# EAGLE design M_I_ext_sound_usb (EAGLE 9.6.2)
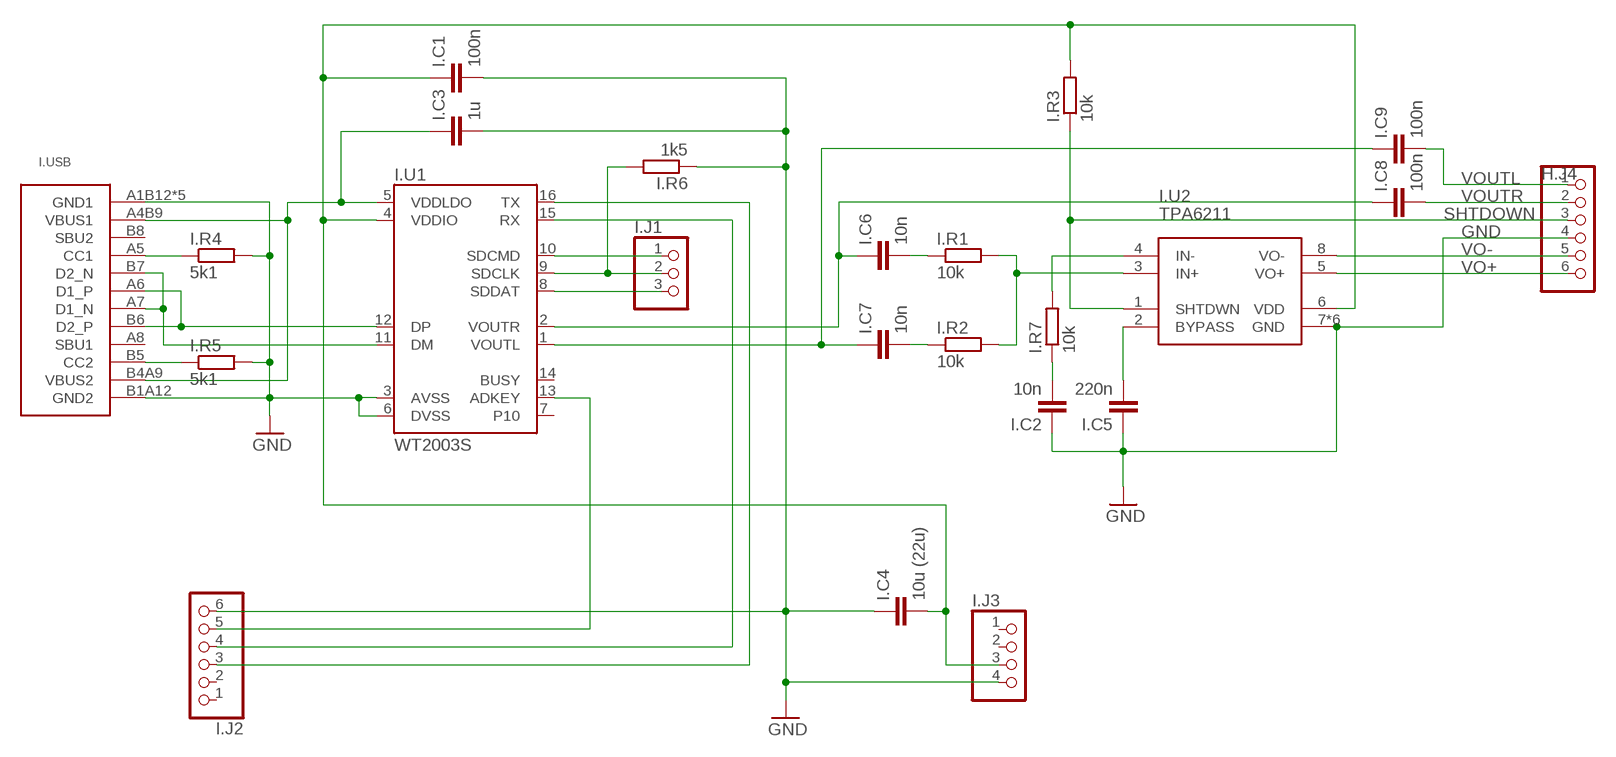
[diagram p0: schematic, sheet 1]

## Parts
H.J4  PINHD-1X6  [1X06]
I.C1  100n  C-EUC0603  [C0603]
I.C2  10n  C-EUC0603  [C0603]
I.C3  1u  C-EUC0603  [C0603]
I.C4  10u (22u)  C-EUC0805  [C0805]
I.C5  220n  C-EUC0603  [C0603]
I.C6  10n  C-EUC0603  [C0603]
I.C7  10n  C-EUC0603  [C0603]
I.C8  100n  C-EUC0603  [C0603]
I.C9  100n  C-EUC0603  [C0603]
I.J1  PINHD-1X3  [1X03]
I.J2  PINHD-1X6  [1X06]
I.J3  PINHD-1X4  [1X04]
I.R1  10k  R-EU_R0603  [R0603]
I.R2  10k  R-EU_R0603  [R0603]
I.R3  10k  R-EU_R0603  [R0603]
I.R4  5k1  R-EU_R0603  [R0603]
I.R5  5k1  R-EU_R0603  [R0603]
I.R6  1k5  R-EU_R0603  [R0603]
I.R7  10k  R-EU_R0603  [R0603]
I.U1  WT2003S  [SO16]
I.U2  TPA6211  [MSOP-POWERPAD-8]
I.USB  USB-C  [USB-C]

## Nets
GND: H.J4.4 I.C1.2 I.C2.1 I.C3.2 I.C4.1 I.C5.1 I.J2.6 I.J3.4 I.R4.2 I.R5.2 I.R6.1 I.U1.3(AVSS) I.U1.6(DVSS) I.U2.7(GND) I.U2.9(GND) I.U2.P$10(GND) I.U2.P$11(GND) I.U2.P$12(GND) I.U2.P$13(GND) I.USB.A1B12(GND1) I.USB.B1A12(GND2) I.USB.SH1(GND1) I.USB.SH2(GND1) I.USB.SH3(GND1) I.USB.SH4(GND1)
N$1: I.R5.1 I.USB.B5(CC2)
N$2: I.R4.1 I.USB.A5(CC1)
N$3: I.J2.5 I.U1.13(ADKEY)
N$6: I.R7.2 I.U2.4(IN-)
N$8: I.C2.2 I.R7.1
N$9: I.U1.12(DP) I.USB.A6(D1_P) I.USB.B6(D2_P)
N$10: I.U1.11(DM) I.USB.A7(D1_N) I.USB.B7(D2_N)
N$11: I.C3.1 I.U1.5(VDDLDO) I.USB.A4B9(VBUS1) I.USB.B4A9(VBUS2)
N$12: I.C6.1 I.C8.1 I.U1.2(VOUTR)
N$13: I.C7.1 I.C9.1 I.U1.1(VOUTL)
N$14: I.R1.2 I.R2.2 I.U2.3(IN+)
N$15: I.C5.2 I.U2.2(BYPASS)
N$17: I.C6.2 I.R1.1
N$18: I.C7.2 I.R2.1
RX: I.J2.4 I.U1.15(RX)
SDCLK: I.J1.2 I.R6.2 I.U1.9(SDCLK)
SDCMD: I.J1.1 I.U1.10(SDCMD)
SDDAT: I.J1.3 I.U1.8(SDDAT)
SHTDOWN: H.J4.3 I.R3.1 I.U2.1(SHTDWN)
TX: I.J2.3 I.U1.16(TX)
VCC: I.C1.1 I.C4.2 I.J3.3 I.R3.2 I.U1.4(VDDIO) I.U2.6(VDD)
VO+: H.J4.6 I.U2.5(VO+)
VO-: H.J4.5 I.U2.8(VO-)
VOUTL: H.J4.1 I.C9.2
VOUTR: H.J4.2 I.C8.2
Unconnected: I.J2.1 I.J2.2 I.J3.1 I.J3.2 I.U1.7(P10) I.U1.14(BUSY) I.USB.A8(SBU1) I.USB.B8(SBU2)

## Library data of the parts
H.J4 I.J2 = pinhead2:PINHD-1X6: PIN HEADER
I.C1-I.C9 = rcl:C-EU: CAPACITOR, European symbol; SPICEPREFIX: C
I.J1 = pinhead2:PINHD-1X3: PIN HEADER
I.J3 = pinhead2:PINHD-1X4: PIN HEADER
I.R1-I.R7 = rcl:R-EU_: RESISTOR, European symbol; SPICEPREFIX: R
I.U1 = WT2003S:WT2003S
I.U2 = hugo:TPA6211
I.USB = hugo:USB-C

## Board
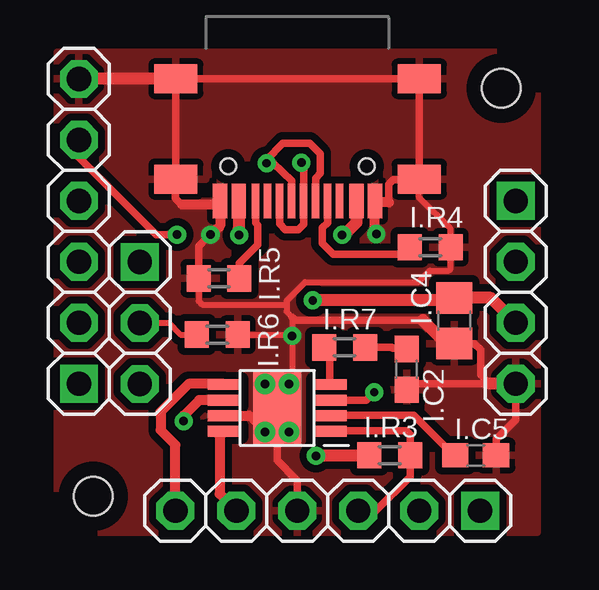
[diagram p1: board, top side]
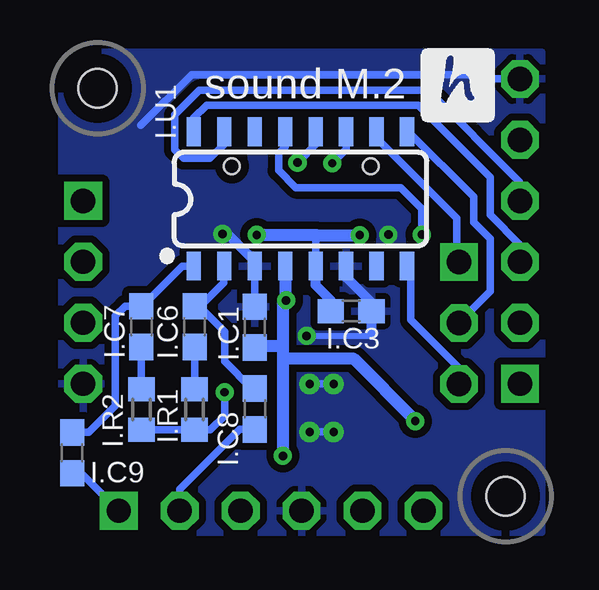
[diagram p2: board, bottom side, seen from below]

No outline drawn. Coordinates in mm, seen from the top.
Copper layers (1*16): Top 0.035mm / dielectric 1.5mm / Bottom 0.035mm
Design rules "default *": minimum track width 10mil, minimum drill 0.35mm, track to track 6mil, track to pad 6mil, pad to pad 6mil, via to via 10mil, smd to smd 6mil, copper to edge 15mil, drill to drill 15mil, minimum pad ring 10mil, minimum via ring 8mil, stop-mask expansion 4mil, vias tented up to drill 0mil, thermal gap 10mil
Holes 1.6 mm at 2,2 19,19
tRestrict: area 18,18 to 20,20; area 1,1 to 3,3
bRestrict: area 1,1 to 3,3; area 18,18 to 20,20

### Footprints (pad centres in the part's own frame; a part is rotated, then mirrored left to right if it is on the bottom)
1X06 = drill 1.016 pad 1.575 square: 1 -6.35,0 | drill 1.016 pad 1.575 octagon: 2 -3.81,0; 3 -1.27,0; 4 1.27,0; 5 3.81,0; 6 6.35,0
C0603 = smd 1.1 x 1: 1 -0.85,0; 2 0.85,0
C0805 = smd 1.3 x 1.5: 1 -0.95,0; 2 0.95,0
1X03 = drill 1.016 pad 1.575 square: 1 -2.54,0 | drill 1.016 pad 1.575 octagon: 2 0,0; 3 2.54,0
1X04 = drill 1.016 pad 1.575 square: 1 -3.81,0 | drill 1.016 pad 1.575 octagon: 2 -1.27,0; 3 1.27,0; 4 3.81,0
R0603 = smd 1 x 1.1: 1 -0.85,0; 2 0.85,0
SO16 = smd 0.6 x 1.2: 1 -4.445,-2.8; 2 -3.175,-2.8; 3 -1.905,-2.8; 4 -0.635,-2.8; 5 0.635,-2.8; 6 1.905,-2.8; 7 3.175,-2.8; 8 4.445,-2.8; 9 4.445,2.8; 10 3.175,2.8; 11 1.905,2.8; 12 0.635,2.8; 13 -0.635,2.8; 14 -1.905,2.8; 15 -3.175,2.8; 16 -4.445,2.8
MSOP-POWERPAD-8 = smd 1.4 x 0.45: 1 -2.184,0.959; 2 -2.184,0.309; 3 -2.184,-0.341; 4 -2.184,-0.991; 5 2.216,-0.991; 6 2.216,-0.341; 7 2.216,0.309; 8 2.216,0.959 | smd 2 x 3: 9 0.016,-0.016 | drill 0.35: P$10 -0.484,-1.016; P$11 0.516,-1.016; P$12 0.516,0.984; P$13 -0.484,0.984
USB-C = smd 0.6 x 1.45: A1B12 -3.235,3.825; A4B9 -2.46,3.825; B1A12 3.215,3.825; B4A9 2.44,3.825 | smd 0.3 x 1.45: A5 -1.26,3.825; A6 -0.26,3.825; A7 0.24,3.825; A8 1.24,3.825; B5 1.74,3.825; B6 0.74,3.825; B7 -0.76,3.825; B8 -1.76,3.825 | smd 1.8 x 1.2: SH1 -5.08,2.91; SH2 -5.08,-1.27; SH3 5.06,-1.27; SH4 5.06,2.91 | hole 0.65: 2.88,2.38; -2.9,2.38

### Placement (x,y rotation side)
H.J4  11.77,1.4 180 top
I.C1  12.45,9.05 90 bottom
I.C2  15.06,7.29 90 top
I.C3  8.44,9.71 0 bottom
I.C4  17.04,9.31 90 top
I.C5  17.93,3.71 180 top
I.C6  14.96,9.07 270 bottom
I.C7  17.17,9.07 270 bottom
I.C8  12.45,5.64 270 bottom
I.C9  20.07,3.81 270 bottom
I.J1  3.94,9.22 270 top
I.J2  1.4,13.04 90 top
I.J3  19.6,10.5 270 top
I.R1  14.96,5.61 270 bottom
I.R2  17.17,5.61 270 bottom
I.R3  14.35,3.71 180 top
I.R4  16.04,12.38 0 top
I.R5  7.24,11.08 180 top
I.R6  7.16,8.74 180 top
I.R7  12.47,8.2 180 top
I.U1  10.55,14.39 0 bottom
I.U2  9.68,5.66 180 top
I.USB  10.5,18.12 180 top

### Tracks (layer width: path | path; a pad name or v marks a point on that pad's centre or on a via)
GND  (via drill 0.35)
  Top 0.254: 15.57,15.19 15.57,14.46 16.89,13.14 I.R4.2 16.89,11.48 16.82,11.4 16.03,11.4 15.54,10.92 10.83,10.92 10.05,10.14 10.05,9.98 | 10.3,8.71 10.3,9.47 10.05,9.71 10.05,9.98 | 10.3,8.71 10.3,8.56 | 10.3,8.56 10.3,6.82 I.U2.P$10 | I.R5.2 6.39,10.14 6.54,9.98 10.05,9.98 | 10.3,8.56 10.29,8.57 v10.29,8.68 | I.R6.1 10.27,8.74 10.3,8.71
  Top 0.305: 5.7,14.15 5.42,14.43 I.USB.SH4 I.USB.SH3 I.USB.SH2 I.USB.SH1 15.53,15.19 | 15.57,15.19 15.53,15.19 | 15.53,15.19 14.5,15.19 14.32,15.01 14.32,14.25 | I.J2.6 | 17.04,8.59 I.C4.1 | I.C4.1 17.04,8.31 | 13.65,12.9 v13.79,12.93 | 8.49,5.36 I.U2.P$12 9.66,5.18 I.U2.9 9.66,3.49 10.5,2.65 H.J4.4 | 9.92,6.14 9.38,6.68 I.U2.P$11 9.16,6.71 9.44,6.99 | I.C4.1 16.71,8.36 | I.C4.1 17.88,8.36 18.14,8.1 18.14,7.06 18.51,6.69 15.23,6.69 I.C2.1 | 10.3,9.47 10.42,9.34 15.74,9.34 | v6.88,12.9 6.39,12.41 I.R5.2 | 17.22,6.69 I.J3.4 19.6,5.19 18.78,4.37 I.C5.1
  Top 0.406: 5.7,14.15 7.11,14.15 I.USB.B1A12 7.29,13.28 v6.88,12.9 | 14.32,14.25 13.76,14.25 I.USB.A1B12 13.73,12.99 v13.79,12.93 | I.U2.7 8.49,5.36
  Top 0.508: I.USB.SH3 I.J2.6 | I.J3.4 18.51,6.69 | 16.71,8.36 15.74,9.34
  Bottom 0.254: v10.29,8.68 7.63,8.68 7.59,8.73
  Bottom 0.305: 12.62,9.73 I.C1.2 I.U1.3 | I.U2.P$10 I.U2.P$11 | I.U2.P$13 I.U2.P$12 | 17.2,17.45 15.08,19.57 2.67,19.57 2.49,19.39 I.J2.6
  Bottom 0.406: I.U1.6 8.64,11.12 7.59,10.06 I.C3.2 7.59,8.73 | I.U1.3 12.45,11.79 13.56,12.9 v13.79,12.93
  pour Top (isolate 0.305): 0.5,20.5 0.5,0.5 20.5,0.5 20.5,20.5
  pour Bottom (isolate 0.305): 0.5,20.5 0.5,0.5 20.5,0.5 20.5,20.5
N$1
  Top 0.254: 8.76,13.39 8.86,13.3
  Top 0.305: I.USB.B5 8.76,13.39 | I.R5.1 8.09,11.71 8.86,12.48 8.86,13.3
N$2
  Top 0.254: I.R4.1 15.19,12.36 14.91,12.08
  Top 0.305: I.USB.A5 11.76,13.4 11.53,13.18 11.53,12.55 12.01,12.08 14.91,12.08
N$3  (via drill 0.35)
  Top 0.305: v5.49,12.9 4.62,12.9 1.4,16.13 I.J2.5
  Bottom 0.305: 11.18,16.75 I.U1.13 11.18,16.57 11.45,16.3 11.45,15.57 10.73,14.86 6.37,14.86 5.49,13.97 v5.49,12.9
N$6
  Top 0.305: I.U2.4 11.86,7.96 I.R7.2
N$8
  Top 0.305: I.C2.2 15.04,8.16 14.47,8.16 14.46,8.18 14.44,8.2 I.R7.1
N$9  (via drill 0.35)
  Top 0.305: v10.67,15.9 10.76,15.9 I.USB.A6 10.76,13.32 10.54,13.11 10.01,13.11 9.76,13.35 I.USB.B6
  Bottom 0.305: I.U1.12 9.91,16.66 v10.67,15.9
N$10  (via drill 0.35)
  Top 0.305: I.USB.A7 10.26,15.14 9.5,15.88 v9.22,15.88 9.22,16.03 9.9,16.71 11.02,16.71 11.45,16.28 11.45,15.47 11.26,15.26 I.USB.B7
  Bottom 0.305: v9.22,15.88 8.64,16.45 I.U1.11
N$11  (via drill 0.35)
  Top 0.508: I.USB.A4B9 12.96,13.4 12.45,12.89 v12.37,12.89 | I.USB.B4A9 8.06,13.13 8.06,13.1 v8.07,12.88
  Bottom 0.305: 9.91,11.92 I.U1.5 9.91,12.85 | 9.91,12.85 9.88,12.88 | 9.96,12.89 9.91,12.85
  Bottom 0.406: I.U1.5 9.91,10.79 9.29,10.17 I.C3.1
  Bottom 0.508: v12.37,12.89 9.96,12.89 | 9.88,12.88 v8.07,12.88 | v8.07,12.88
N$12
  Bottom 0.305: I.U1.2 13.75,11.57 13.75,10.9 14.73,9.92 I.C6.1 14.76,9.92 13.7,8.86 13.7,7.62 12.57,6.49 I.C8.1
N$13
  Bottom 0.305: I.C7.1 17.14,9.92 15.47,11.59 I.U1.1 | I.C7.1 17.17,9.78 | I.C7.1 17.85,9.92 18.25,9.52 18.25,5.77 19.36,4.66 I.C9.1
N$14  (via drill 0.35)
  Top 0.305: I.U2.3 13.38,6 v13.71,6.33
  Bottom 0.305: I.R2.2 I.R1.2 14.3,4.76 13.71,5.36 v13.71,6.33
N$15
  Top 0.305: I.U2.2 11.88,5.37 15.35,5.37 17.01,3.71 I.C5.2
N$17
  Bottom 0.305: I.C6.2 I.R1.1
N$18
  Bottom 0.305: I.C7.2 I.R2.1
RX
  Bottom 0.305: I.J2.4 1.43,14.34 1.43,15.11 5.23,18.91 14.76,18.91 15.77,17.89 15.77,16.43 15.42,16.08 14.32,16.08 13.72,16.68 I.U1.15
SDCLK
  Top 0.254: I.J1.2 5.14,9.22 5.63,8.74 I.R6.2
  Bottom 0.305: I.U1.9 6.05,17.19 3.33,14.47 3.33,13.41 2.64,12.72 2.64,10.54 3.94,9.25 I.J1.2
SDCMD
  Bottom 0.305: I.U1.10 7.37,16.92 4.04,13.58 4.04,11.86 I.J1.1
SDDAT
  Bottom 0.305: I.U1.8 5.95,11.44 5.95,9.35 3.94,7.34 I.J1.3
SHTDOWN
  Top 0.305: 12.2,4.71 I.U2.1 11.89,4.73 15.04,4.73 15.2,4.57 I.R3.1 15.2,2.82 13.78,1.4 H.J4.3
TX
  Bottom 0.305: I.J2.3 1.4,12.48 2.65,13.72 2.65,15.3 5.65,18.3 14.45,18.3 14.99,17.76 I.U1.16
VCC  (via drill 0.35)
  Top 0.305: I.R3.2 13.61,3.71
  Top 0.406: I.U2.6 6.41,6 5.77,5.36 v5.77,5.13
  Top 0.508: I.J3.3 18.57,10.26 I.C4.2 16.94,10.16 v11.14,10.16 | 13.61,3.71 13.59,3.68 v11.28,3.68
  Bottom 0.305: 11.41,8.25 12.4,8.25 I.C1.1
  Bottom 0.508: I.U1.4 11.18,10.32 11.14,10.29 v11.14,10.16 | 11.12,10.13 v11.14,10.16 | v5.77,5.13 5.77,5.16 8.36,7.75 11.28,7.75 | 11.28,7.75 v11.28,3.68 | v11.14,10.16 11.28,10.03 11.28,8.26 | 11.28,8.26 11.28,7.75 | 11.43,8.23 11.41,8.25 | 11.28,8.26 12.39,8.26 I.C1.1
VO+
  Top 0.406: I.U2.5 7.44,6.68 5.97,6.68 4.8,5.51 4.8,4.76 5.42,4.14 H.J4.6
VO-
  Top 0.406: H.J4.5 7.26,2.1 7.26,4.5 I.U2.8
VOUTL
  Bottom 0.305: I.C9.2 19.68,2.96 H.J4.1
VOUTR
  Bottom 0.305: H.J4.2 15.58,2.29 13.08,4.79 I.C8.2

### Text on the board
bPlace: sound M.2